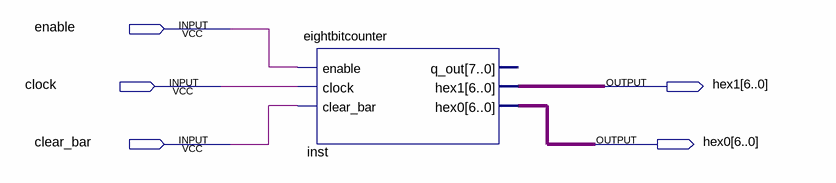
[diagram p0: schematic sheet]
// Quartus schematic synchronus4BitCounter.bdf as structural Verilog: 1 symbols, 5 pins
module synchronus4BitCounter (
  input  enable,
  input  clock,
  input  clear_bar,
  output [6:0] hex1,
  output [6:0] hex0
);

  eightbitcounter inst (
    .enable(enable), .clock(clock), .clear_bar(clear_bar), .hex1(hex1), .hex0(hex0));  // open: q_out
endmodule
